# Altium project stm32-unit.PrjPcb
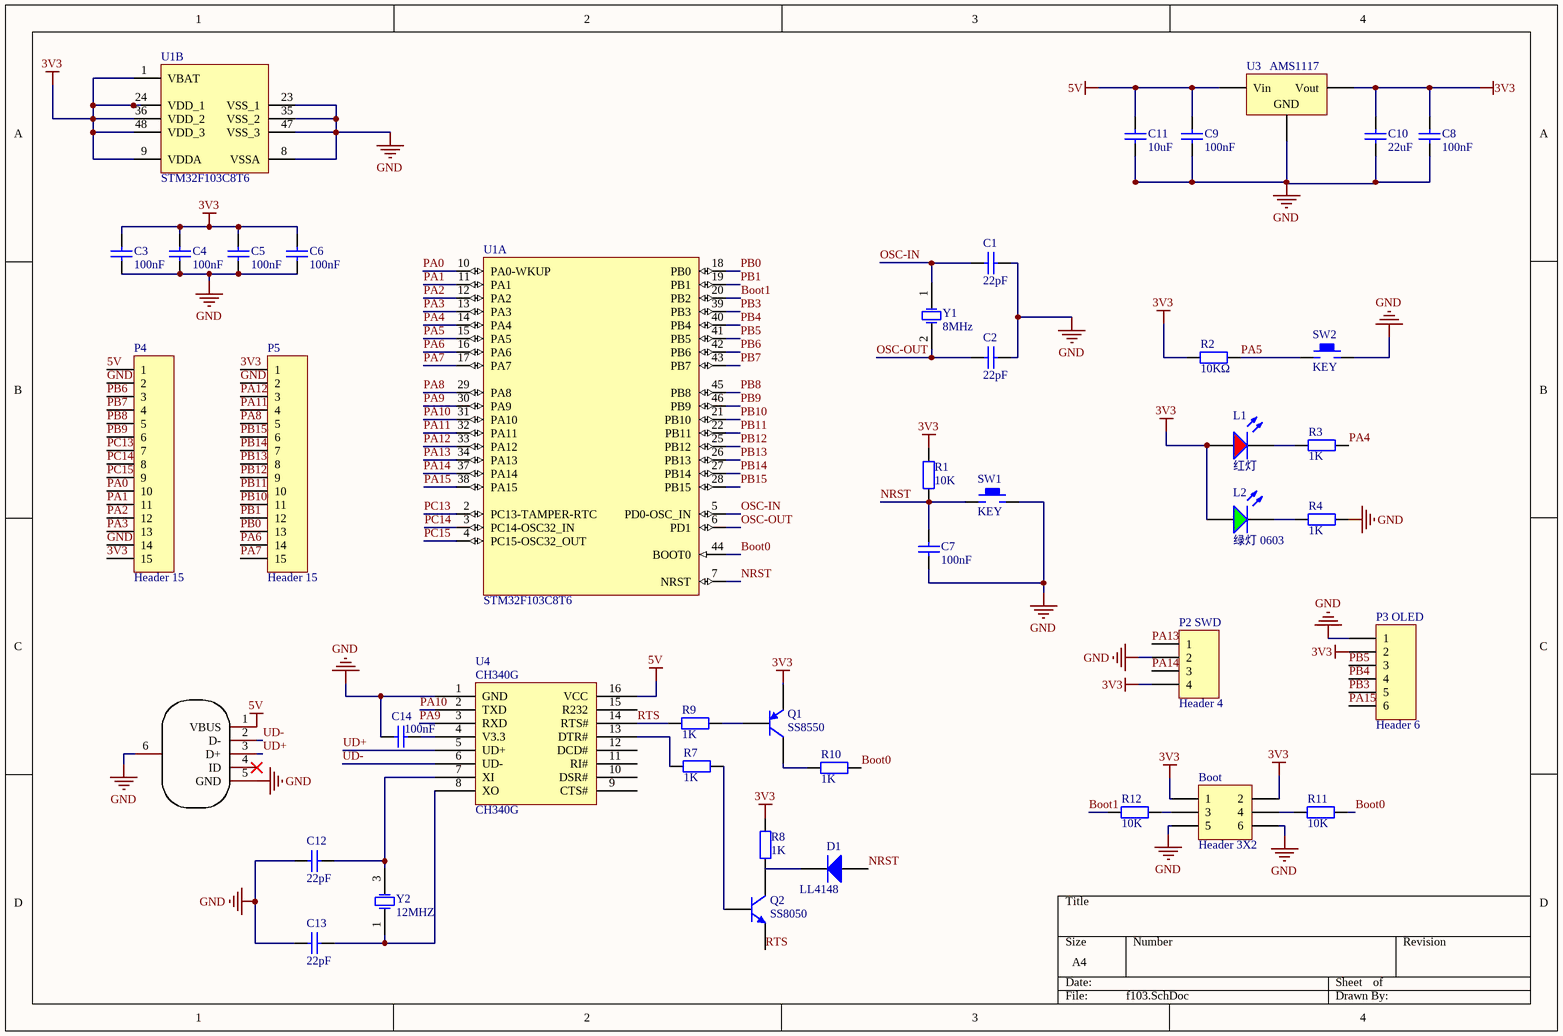
[diagram p0: f103.SchDoc]
1 sheet, 42 parts. Net scope: global (net labels, ports and power ports of the same name join across sheets).

## Sheet f103.SchDoc: stm32f103 unit system
size A4

### Parts
Boot  Header 3X2  [HDR2X3]
C1  22pF  [0603_C]
C2  22pF  [0603_C]
C3  100nF  [0603_C]
C4  100nF  [0603_C]
C5  100nF  [0603_C]
C6  100nF  [0603_C]
C7  100nF  [0603_C]
C8  100nF  [0603_C]
C9  100nF  [0603_C]
C10  22uF  [0603_C]
C11  10uF  [0603_C]
C12  22pF  [0603_C]
C13  22pF  [0603_C]
C14  100nF  [0603_C]
D1  LL4148  [LL-34]
L1  红灯  [0603_LED_S1]
L2  绿灯 0603  [0603_LED_S1]
P2_SWD  Header 4  [HDR1X4]
P3_OLED  Header 6  [HDR1X6]
P4  Header 15  [HDR1X15]
P5  Header 15  [HDR1X15]
Q1  SS8550  [SOT-23(SOT-23-3)]
Q2  SS8050  [SOT-23(SOT-23-3)]
R1  10K  [0603_R]
R2  10KΩ  [0603_R]
R3  1K  [0603_R]
R4  1K  [0603_R]
R7  1K  [0603_R]
R8  1K  [0603_R]
R9  1K  [0603_R]
R10  1K  [0603_R]
R11  10K  [0603_R]
R12  10K  [0603_R]
SW1  KEY  [KEY_M]
SW2  KEY  [KEY_M]
U1  STM32F103C8T6  [LQFP-48_7x7x05P]  (parts A,B of 2)
U3  AMS1117  [SOT-223]
U4  CH340G  [SOIC-16_150mil]
USB  U254-051T-4BH23-S2S  [MICRO-USB-SMD_U254-051T-4BH23-S2S]  (value not drawn)
Y1  8MHz  [SMD-5032_2P]
Y2  12MHZ  [SMD-3225_4P]

### Nets
3V3: Boot.1 Boot.2 C3.2 C4.2 C5.2 C6.2 C8.2 C10.1 L1.A L2.A P2_SWD.4 P3_OLED.2 P4.15 P5.1 Q1.2(E) R1.2 R2.1 R8.2 U1.1(VBAT) U1.9(VDDA) U1.24(VDD_1) U1.36(VDD_2) U1.48(VDD_3) U3.2(Vout)
5V: C9.2 C11.1 P4.1 U3.3(Vin) U4.16(VCC) USB.1(VBUS)
GND: Boot.5 Boot.6 C1.1 C2.1 C3.1 C4.1 C5.1 C6.1 C7.1 C8.1 C9.1 C10.2 C11.2 C12.1 C13.1 C14.1 P2_SWD.2 P3_OLED.1 P4.2 P4.14 P5.2 R4.2 SW1.2 SW2.2 U1.8(VSSA) U1.23(VSS_1) U1.35(VSS_2) U1.47(VSS_3) U3.1(GND) U4.1(GND) USB.5(GND) USB.6(EH)
Boot0: R10.2 R11.2 U1.44(BOOT0)
Boot1: R12.1 U1.20(PB2)
NRST: C7.2 D1.1(A) R1.1 SW1.1 U1.7(NRST)
OSC-IN: C1.2 U1.5(PD0-OSC_IN) Y1.1(OSC1)
OSC-OUT: C2.2 U1.6(PD1) Y1.2(OSC2)
PA0: P4.10 U1.10(PA0-WKUP)
PA1: P4.11 U1.11(PA1)
PA2: P4.12 U1.12(PA2)
PA3: P4.13 U1.13(PA3)
PA4: R3.2 U1.14(PA4)
PA5: R2.2 SW2.1 U1.15(PA5)
PA6: P5.14 U1.16(PA6)
PA7: P5.15 U1.17(PA7)
PA8: P5.5 U1.29(PA8)
PA9: U1.30(PA9) U4.3(RXD)
PA10: U1.31(PA10) U4.2(TXD)
PA11: P5.4 U1.32(PA11)
PA12: P5.3 U1.33(PA12)
PA13: P2_SWD.1 U1.34(PA13)
PA14: P2_SWD.3 U1.37(PA14)
PA15: P3_OLED.6 U1.38(PA15)
PB0: P5.13 U1.18(PB0)
PB1: P5.12 U1.19(PB1)
PB3: P3_OLED.5 U1.39(PB3)
PB4: P3_OLED.4 U1.40(PB4)
PB5: P3_OLED.3 U1.41(PB5)
PB6: P4.3 U1.42(PB6)
PB7: P4.4 U1.43(PB7)
PB8: P4.5 U1.45(PB8)
PB9: P4.6 U1.46(PB9)
PB10: P5.11 U1.21(PB10)
PB11: P5.10 U1.22(PB11)
PB12: P5.9 U1.25(PB12)
PB13: P5.8 U1.26(PB13)
PB14: P5.7 U1.27(PB14)
PB15: P5.6 U1.28(PB15)
PC13: P4.7 U1.2(PC13-TAMPER-RTC)
PC14: P4.8 U1.3(PC14-OSC32_IN)
PC15: P4.9 U1.4(PC15-OSC32_OUT)
RTS: Q2.2(E) R9.1 U4.14(RTS#)
UD+: U4.5(UD+) USB.3(D+)
UD-: U4.6(UD-) USB.2(D-)
NetBoot_3: Boot.3 R12.2
NetBoot_4: Boot.4 R11.1
NetC12_2: C12.2 U4.7(XI) Y2.3(OSC2)
NetC13_2: C13.2 U4.8(XO) Y2.1(OSC1)
NetC14_2: C14.2 U4.4(V3.3)
NetD1_2: D1.2(K) Q2.3(C)
NetL1_K: L1.K R3.1
NetL2_K: L2.K R4.1
NetQ1_1: Q1.1(B) R9.2
NetQ1_3: Q1.3(C) R10.1
NetQ2_1: Q2.1(B) R7.2
NetR7_1: R7.1 U4.13(DTR#)

Not connected (* = marked no-connect by the designer): R8 1; U4 9(CTS#) 10(DSR#) 11(RI#) 12(DCD#) 15(R232); USB 4(ID)*

### Library data of the parts
Boot = Header 3X2: Header, 3-Pin, Dual row; LatestRevisionDate: 17-Jul-2002; LatestRevisionNote: Re-released for DXP Platform.; Publisher: Altium Limited
C1 C2 C12 C13 = 0603 22pF (220) 5% 50V: 贴片电容; ComponentLink1Description: 供应商链接; ComponentLink1URL: http://www.szlcsc.com/product/details_2005.html; Package: 0603; Supplier: LC; SuppliersPartNumber: C1653
C3-C9 C14 = 0603 100nF (104) 10% 50V: 贴片电容; ComponentLink1Description: 供应商链接; ComponentLink1URL: http://www.szlcsc.com/product/details_15331.html; Package: 0603; Supplier: LC; SuppliersPartNumber: C14663
C10 = 0603 22uF (226) 20% 6.3V: 贴片电容; ComponentLink1Description: 供应商链接; ComponentLink1URL: http://www.szlcsc.com/product/details_60514.html; Package: 0603; Supplier: LC; SuppliersPartNumber: C59461
C11 = 0603 10uF (106) 10% 10V: 贴片电容; ComponentLink1Description: 供应商链接; ComponentLink1URL: http://www.szlcsc.com/product/details_20411.html; Package: 0603; Supplier: LC; SuppliersPartNumber: C19702
D1 = LL-34 LL4148 LL-34 1206: 开关二极管; ComponentLink1Description: 供应商链接; ComponentLink1URL: http://www.szlcsc.com/product/details_10338.html; Package: LL-34; Supplier: LC; SuppliersPartNumber: C9808
L1 = 0603 红灯: 发光二极管; ComponentLink1Description: 供应商链接; ComponentLink1URL: http://www.szlcsc.com/product/details_2659.html; Package: 0603; Supplier: LC; SuppliersPartNumber: C2286
L2 = 0603 绿灯: 发光二极管; ComponentLink1Description: 供应商链接; ComponentLink1URL: http://www.szlcsc.com/product/details_73152.html; Package: 0603; Supplier: LC; SuppliersPartNumber: C72043
P2_SWD = Header 4: Header, 4-Pin; LatestRevisionDate: 17-Jul-2002; LatestRevisionNote: Re-released for DXP Platform.; Publisher: Altium Limited
P3_OLED = Header 6: Header, 6-Pin; LatestRevisionDate: 17-Jul-2002; LatestRevisionNote: Re-released for DXP Platform.; Publisher: Altium Limited
P4 P5 = Header 15: Header, 15-Pin; LatestRevisionDate: 17-Jul-2002; LatestRevisionNote: Re-released for DXP Platform.; Publisher: Altium Limited
Q1 = SOT-23 SS8550 Y2: 三极管; ComponentLink1Description: 供应商链接; ComponentLink1URL: http://www.szlcsc.com/product/details_9037.html; Package: SOT-23; Supplier: LC; SuppliersPartNumber: C8542
Q2 = SOT-23 SS8050 Y1: 三极管; ComponentLink1Description: 供应商链接; ComponentLink1URL: http://www.szlcsc.com/product/details_2507.html; Package: SOT-23; Supplier: LC; SuppliersPartNumber: C2150
R1 R2 R11 R12 = 0603 10KΩ (1002) 1%: 贴片电阻; ComponentLink1Description: 供应商链接; ComponentLink1URL: http://www.szlcsc.com/product/details_26547.html; Package: 0603; Supplier: LC; SuppliersPartNumber: C25804
R3 R4 R7-R10 = 0603 1KΩ (1001) 1%: 贴片电阻; ComponentLink1Description: 供应商链接; ComponentLink1URL: http://www.szlcsc.com/product/details_21904.html; Package: 0603; Supplier: LC; SuppliersPartNumber: C21190
U1 = STM32F103C8T6: ARM; ComponentLink1Description: 供应商链接; ComponentLink1URL: http://www.szlcsc.com/product/details_9243.html; Package: LQFP-48_7x7x05P; Supplier: LC; SuppliersPartNumber: C8734
U3 = SOT-223 AMS1117-3.3: 低压差线性稳压(LDO); ComponentLink1Description: 供应商链接; ComponentLink1URL: http://www.szlcsc.com/product/details_6652.html; Package: SOT-223; Supplier: LC; SuppliersPartNumber: C6186
U4 = CH340G_[C14267]: USB; ComponentLink1Description: 供应商链接; ComponentLink1URL: http://www.szlcsc.com/product/details_14927.html; Package: SOIC-16_150mil; Supplier: LC; SuppliersPartNumber: C14267
USB = U254-051T-4BH23-S2S: Manufacturer: XKB Connectivity(中国星坤); Symbol: U254-051T-4BH23-S2S_C482361; Add into BOM: yes; Connector Type: Micro-B; Gender: 母; Number of Ports: 1; Number of Contacts: 5P; Current Rating - Power (Max): 1.8A; Soldering Temperature(Max): 260℃; Device: U254-051T-4BH23-S2S; Supplier: LCSC; Supplier Part: C482361; Manufacturer Part: U254-051T-4BH23-S2S; JLCPCB Part Class: Extended Part; LCSC Part Name: Micro-B 母 卧贴; Supplier Footprint: SMD; Datasheet: https://atta.szlcsc.com/upload/public/pdf/source/20211011/BAA279962023C91D65D7E291D0BA8E57.pdf; Convert to PCB: yes; Standard: USB 2.0; Mounting Style: 卧贴; Contact Material: 铜合金; Contact Plating: 金; Operating Temperature Range: -40℃~+85℃
Y1 = SMD-5032_2P 8MHz 20ppm 20pF: 贴片晶振; ComponentLink1Description: 供应商链接; ComponentLink1URL: http://www.szlcsc.com/product/details_117214.html; Package: SMD-5032_2P; Supplier: LC; SuppliersPartNumber: C115962
Y2 = SMD-3225_4P  12MHZ 20PF 10PPM: 贴片晶振; ComponentLink1Description: 供应商链接; ComponentLink1URL: http://www.szlcsc.com/product/details_9522.html; Package: SMD-3225_4P; Supplier: LC; SuppliersPartNumber: C9002